# Altium schematic sheet PowerInput.SchDoc: Power
size A3; SheetNumber: 2; SheetTotal: 10
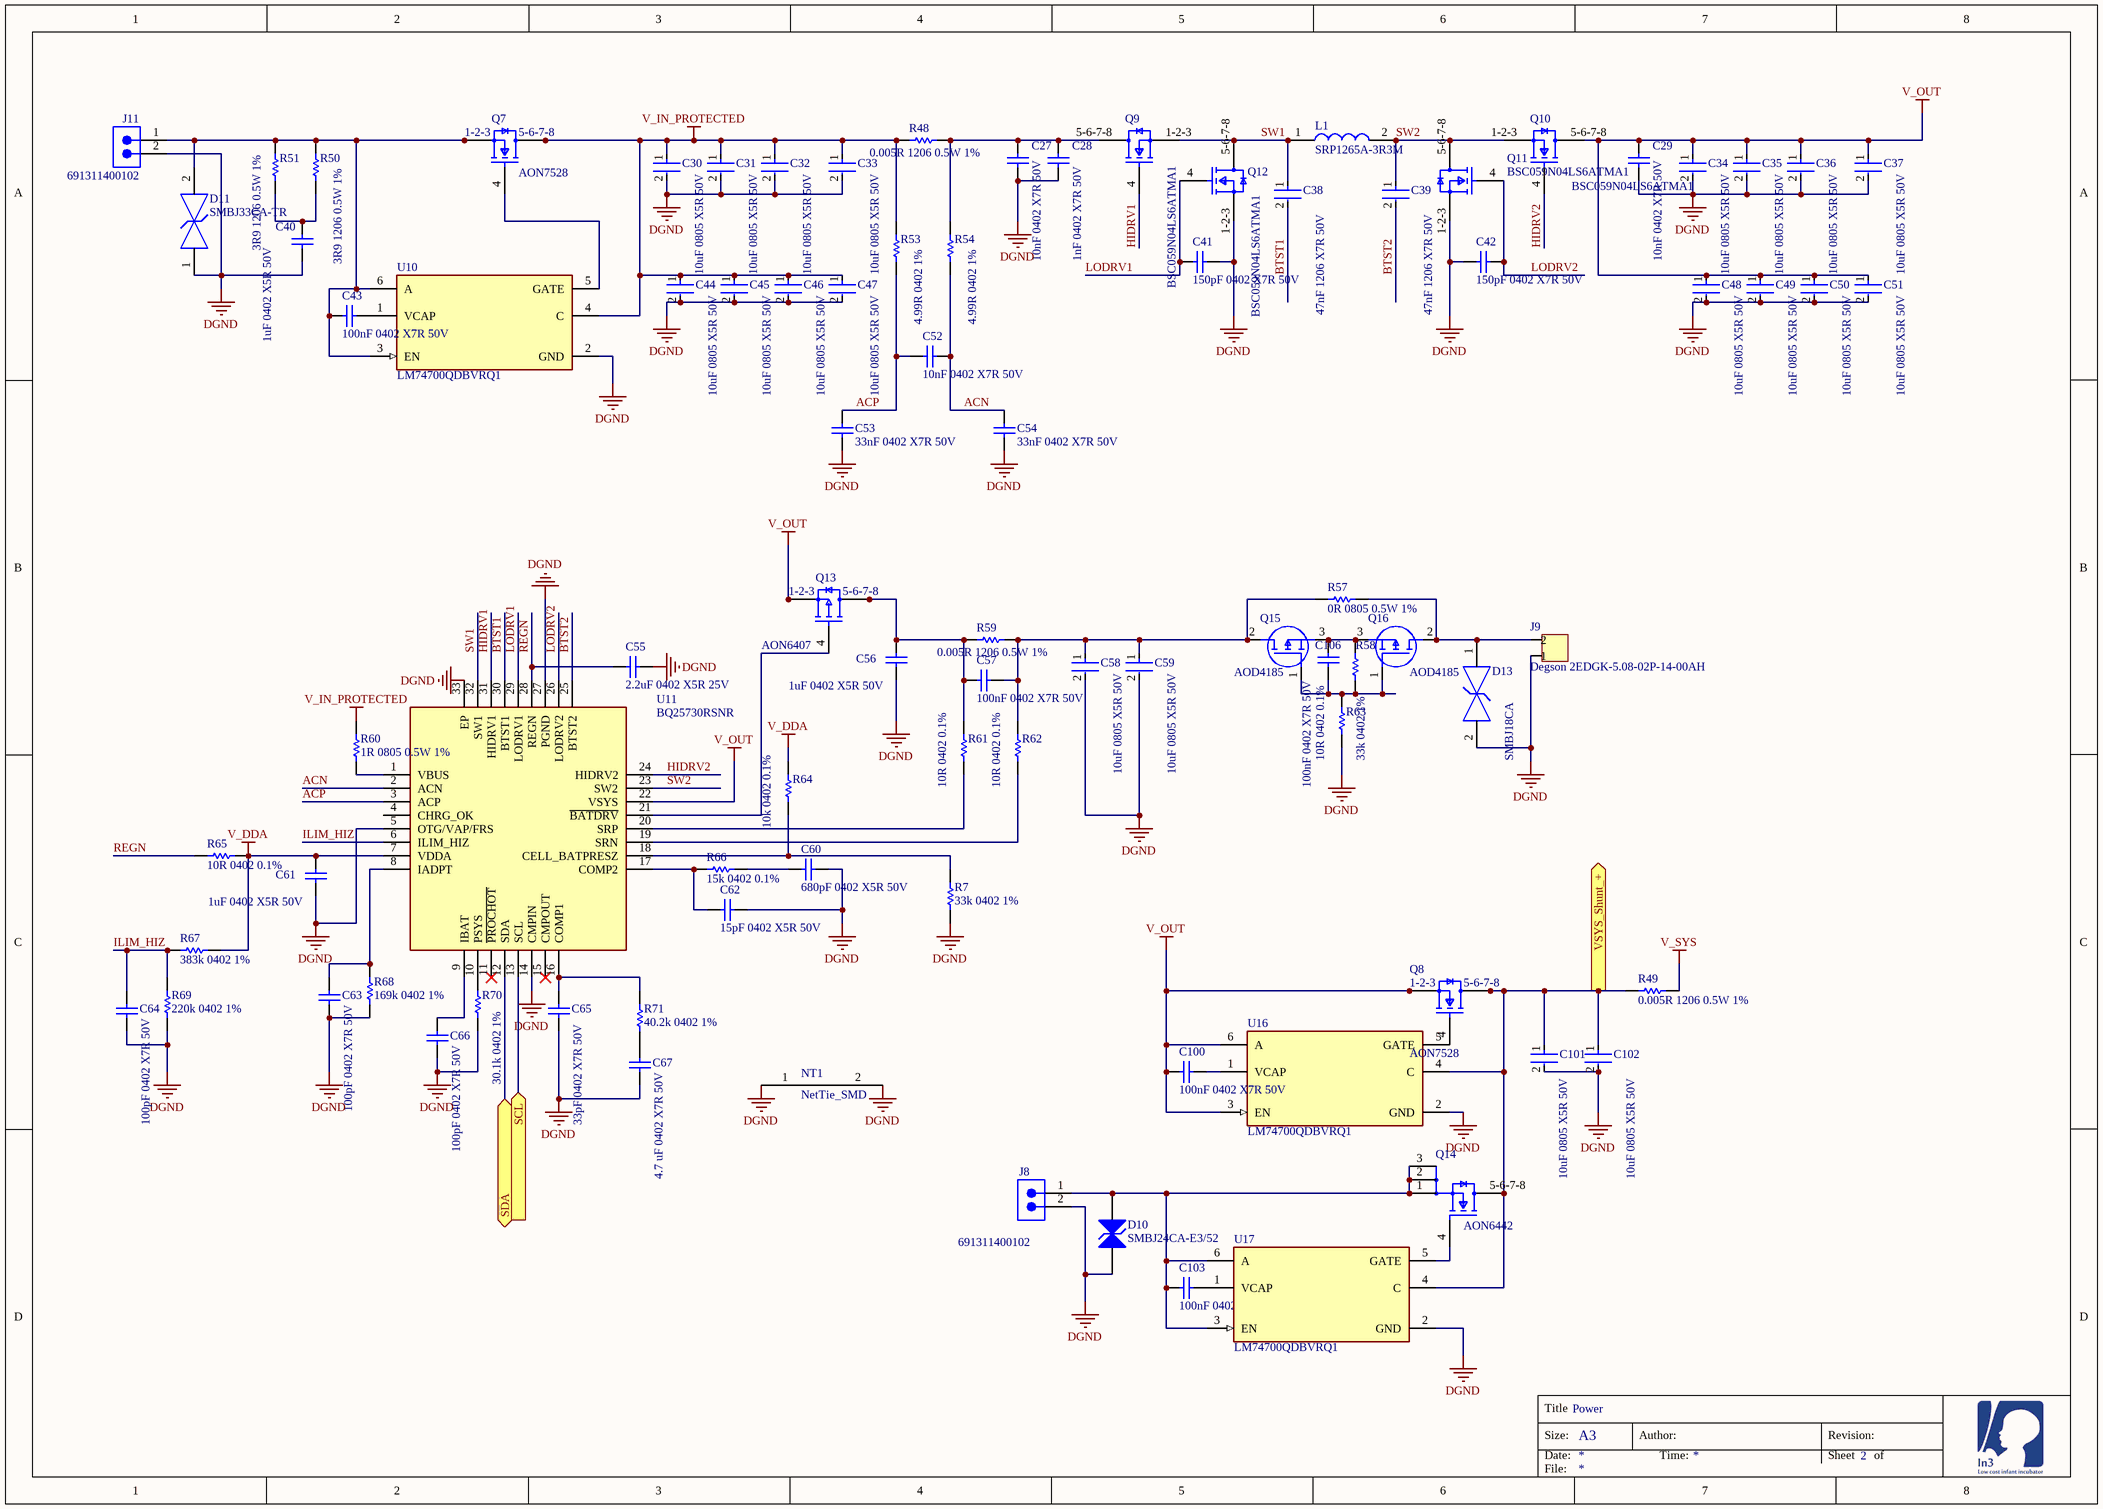
[diagram p0: PowerInput.SchDoc]

## Parts
C27  10nF 0402 X7R 50V  [CAPC1005X55X25NL5T10]
C28  1nF 0402 X7R 50V  [CAPC1005X55X25NL5T10]
C29  10nF 0402 X7R 50V  [CAPC1005X55X25NL5T10]
C30  10uF 0805 X5R 50V  [FP-GRM21B-0_2-e0_2_0_7-MFG]
C31  10uF 0805 X5R 50V  [FP-GRM21B-0_2-e0_2_0_7-MFG]
C32  10uF 0805 X5R 50V  [FP-GRM21B-0_2-e0_2_0_7-MFG]
C33  10uF 0805 X5R 50V  [FP-GRM21B-0_2-e0_2_0_7-MFG]
C34  10uF 0805 X5R 50V  [FP-GRM21B-0_2-e0_2_0_7-MFG]
C35  10uF 0805 X5R 50V  [FP-GRM21B-0_2-e0_2_0_7-MFG]
C36  10uF 0805 X5R 50V  [FP-GRM21B-0_2-e0_2_0_7-MFG]
C37  10uF 0805 X5R 50V  [FP-GRM21B-0_2-e0_2_0_7-MFG]
C38  47nF 1206 X7R 50V  [FP-CC1206-FD-MFG]
C39  47nF 1206 X7R 50V  [FP-CC1206-FD-MFG]
C40  1uF 0402 X5R 50V  [CAPC1005X55X25NL5T10]
C41  150pF 0402 X7R 50V  [CAPC1005X55X25NL5T10]
C42  150pF 0402 X7R 50V  [CAPC1005X55X25NL5T10]
C43  100nF 0402 X7R 50V  [CAPC1005X55X25NL5T10]
C44  10uF 0805 X5R 50V  [FP-GRM21B-0_2-e0_2_0_7-MFG]
C45  10uF 0805 X5R 50V  [FP-GRM21B-0_2-e0_2_0_7-MFG]
C46  10uF 0805 X5R 50V  [FP-GRM21B-0_2-e0_2_0_7-MFG]
C47  10uF 0805 X5R 50V  [FP-GRM21B-0_2-e0_2_0_7-MFG]
C48  10uF 0805 X5R 50V  [FP-GRM21B-0_2-e0_2_0_7-MFG]
C49  10uF 0805 X5R 50V  [FP-GRM21B-0_2-e0_2_0_7-MFG]
C50  10uF 0805 X5R 50V  [FP-GRM21B-0_2-e0_2_0_7-MFG]
C51  10uF 0805 X5R 50V  [FP-GRM21B-0_2-e0_2_0_7-MFG]
C52  10nF 0402 X7R 50V  [CAPC1005X55X25NL5T10]
C53  33nF 0402 X7R 50V  [CAPC1005X55X25NL5T10]
C54  33nF 0402 X7R 50V  [CAPC1005X55X25NL5T10]
C55  2.2uF 0402 X5R 25V  [CAPC1005X55X25NL5T10]
C56  1uF 0402 X5R 50V  [CAPC1005X55X25NL5T10]
C57  100nF 0402 X7R 50V  [CAPC1005X55X25NL5T10]
C58  10uF 0805 X5R 50V  [FP-GRM21B-0_2-e0_2_0_7-MFG]
C59  10uF 0805 X5R 50V  [FP-GRM21B-0_2-e0_2_0_7-MFG]
C60  680pF 0402 X5R 50V  [CAPC1005X55X25NL5T10]
C61  1uF 0402 X5R 50V  [CAPC1005X55X25NL5T10]
C62  15pF 0402 X5R 50V  [CAPC1005X55X25NL5T10]
C63  100pF 0402 X7R 50V  [CAPC1005X55X25NL5T10]
C64  100pF 0402 X7R 50V  [CAPC1005X55X25NL5T10]
C65  33pF 0402 X7R 50V  [CAPC1005X55X25NL5T10]
C66  100pF 0402 X7R 50V  [CAPC1005X55X25NL5T10]
C67  4.7 uF 0402 X7R 50V  [CAPC1005X55X25NL5T10]
C100  100nF 0402 X7R 50V  [CAPC1005X55X25NL5T10]
C101  10uF 0805 X5R 50V  [FP-GRM21B-0_2-e0_2_0_7-MFG]
C102  10uF 0805 X5R 50V  [FP-GRM21B-0_2-e0_2_0_7-MFG]
C103  100nF 0402 X7R 50V  [CAPC1005X55X25NL5T10]
C106  100nF 0402 X7R 50V  [CAPC1005X55X25NL5T10]
D10  SMBJ24CA-E3/52  [VISH-DO-214AA-A-2_V]
D11  SMBJ33CA-TR  [FP-SMB-CA-MFG]
D13  SMBJ18CA  [FP-SMBJ-MFG]
J8  691311400102  [691311400102]
J9  Degson 2EDGK-5.08-02P-14-00AH  [PCB-h4cyb3wxd4gf7j132tzl-1]
J11  691311400102  [691311400102]
L1  SRP1265A-3R3M  [INDPM135125X650N]
NT1  NetTie_SMD  [NETTIE_SMD]  (net tie, no BOM)
Q7  AON7528  [AON7520]
Q8  AON7528  [AON7520]
Q9  BSC059N04LS6ATMA1  [FP-PG-TDSON-8-MFG]
Q10  BSC059N04LS6ATMA1  [FP-PG-TDSON-8-MFG]
Q11  BSC059N04LS6ATMA1  [FP-PG-TDSON-8-MFG]
Q12  BSC059N04LS6ATMA1  [FP-PG-TDSON-8-MFG]
Q13  AON6407  [AON6414A]
Q14  AON6442  [FP-DFN5x6_8L_EP1_P-MFG]
Q15  AOD4185  [AOD4185]
Q16  AOD4185  [AOD4185]
R7  33k 0402 1%  [RESC1005X40X25ML05T10]
R48  0.005R 1206 0.5W 1%  [CAPC3216X180X55ML20T25]
R49  0.005R 1206 0.5W 1%  [CAPC3216X180X55ML20T25]
R50  3R9 1206 0.5W 1%  [CAPC3216X180X55ML20T25]
R51  3R9 1206 0.5W 1%  [CAPC3216X180X55ML20T25]
R53  4.99R 0402 1%  [RESC1005X40X25ML05T10]
R54  4.99R 0402 1%  [RESC1005X40X25ML05T10]
R57  0R 0805 0.5W 1%  [RESC2013X65X40LL15T20]
R58  33k 0402 1%  [RESC1005X40X25ML05T10]
R59  0.005R 1206 0.5W 1%  [CAPC3216X180X55ML20T25]
R60  1R 0805 0.5W 1%  [RESC2013X65X40LL15T20]
R61  10R 0402 0.1%  [RESC1005X40X25ML05T10]
R62  10R 0402 0.1%  [RESC1005X40X25ML05T10]
R63  10R 0402 0.1%  [RESC1005X40X25ML05T10]
R64  10k 0402 0.1%  [RESC1005X40X25ML05T10]
R65  10R 0402 0.1%  [RESC1005X40X25ML05T10]
R66  15k 0402 0.1%  [RESC1005X40X25ML05T10]
R67  383k 0402 1%  [RESC1005X40X25ML05T10]
R68  169k 0402 1%  [RESC1005X40X25ML05T10]
R69  220k 0402 1%  [RESC1005X40X25ML05T10]
R70  30.1k 0402 1%  [RESC1005X40X25ML05T10]
R71  40.2k 0402 1%  [RESC1005X40X25ML05T10]
U10  LM74700QDBVRQ1  [FP-DBV0006A-MFG]
U11  BQ25730RSNR  [QFN40P400X400X80-33N-D]
U16  LM74700QDBVRQ1  [FP-DBV0006A-MFG]
U17  LM74700QDBVRQ1  [FP-DBV0006A-MFG]

## Ports
SCL (in), SDA (bidir), VSYS_Shunt_+ (out)

## Nets
DGND: C27.1 C28.1 C29.1 C30.2 C31.2 C32.2 C33.2 C34.2 C35.2 C36.2 C37.2 C40.1 C41.1 C42.1 C44.2 C45.2 C46.2 C47.2 C48.2 C49.2 C50.2 C51.2 C53.2 C54.2 C55.1 C56.1 C58.2 C59.2 C60.1 C61.1 C62.1 C63.2 C64.2 C65.2 C66.2 C67.2 C101.2 C102.2 D10.1(A) D11.1 D13.2 J8.2 J9.1 J11.2 NT1.1 NT1.2 Q11.1-2-3(S) Q12.1-2-3(S) R7.2 R63.1 R68.2 R69.2 R70.2 U10.2(GND) U11.5(OTG/VAP/FRS) U11.14(CMPIN) U11.27(PGND) U11.33(EP) U16.2(GND) U17.2(GND)
V_DDA: C61.2 R64.2 R65.1 R67.1 U11.7(VDDA)
V_IN_PROTECTED: C30.1 C31.1 C32.1 C33.1 C44.1 C45.1 C46.1 C47.1 Q7.5(D) Q7.6(D) Q7.7(D) Q7.8(D) Q7.9(D) R48.2 R53.2 R60.2 U10.4(C)
V_OUT: C29.2 C34.1 C35.1 C36.1 C37.1 C48.1 C49.1 C50.1 C51.1 C100.2 Q8.1(1-2-3) Q8.2(S) Q8.3(S) Q10.5-6-7-8(D) Q13.1(1-2-3) Q13.2(S) Q13.3(S) U11.22(VSYS) U16.3(EN) U16.6(A)
V_SYS: R49.1
ACN: C52.1 C54.1 R54.1 U11.2(ACN)
ACP: C52.2 C53.1 R53.1 U11.3(ACP)
BTST1: C38.2 U11.30(BTST1)
BTST2: C39.2 U11.25(BTST2)
HIDRV1: Q9.4(G) U11.31(HIDRV1)
HIDRV2: Q10.4(G) U11.24(HIDRV2)
ILIM_HIZ: C64.1 R67.2 R69.1 U11.6(ILIM_HIZ)
LODRV1: C41.2 Q12.4(G) U11.29(LODRV1)
LODRV2: C42.2 Q11.4(G) U11.26(LODRV2)
REGN: C55.2 R65.2 U11.28(REGN)
SCL: U11.13(SCL) ; port SCL
SDA: U11.12(SDA) ; port SDA
SW1: C38.1 L1.1 Q9.1-2-3(S) Q12.5-6-7-8(D) U11.32(SW1)
SW2: C39.1 L1.2 Q10.1-2-3(S) Q11.5-6-7-8(D) U11.23(SW2)
VSYS_Shunt_+: C101.1 C102.1 Q8.5(D) Q8.6(D) Q8.7(D) Q8.8(D) Q8.9(D) Q14.5-6-7-8(D) R49.2 U16.4(C) U17.4(C) ; port VSYS_Shunt_+
NetC27_2: C27.2 C28.2 Q9.5-6-7-8(D) R48.1 R54.2
NetC40_2: C40.2 R50.2 R51.2
NetC43_1: C43.1 U10.1(VCAP)
NetC43_2: C43.2 D11.2 J11.1 Q7.1(1-2-3) Q7.2(S) Q7.3(S) R50.1 R51.1 U10.3(EN) U10.6(A)
NetC56_2: C56.2 C57.2 Q13.5(D) Q13.6(D) Q13.7(D) Q13.8(D) Q13.9(D) R59.2 R61.2
NetC57_1: C57.1 C58.1 C59.1 Q15.2(D) R57.1 R59.1 R62.2
NetC60_2: C60.2 R66.1
NetC62_2: C62.2 R66.2 U11.17(COMP2)
NetC63_1: C63.1 R68.1 U11.8(IADPT)
NetC65_1: C65.1 R71.1 U11.16(COMP1)
NetC66_1: C66.1 U11.9(IBAT)
NetC67_1: C67.1 R71.2
NetC100_1: C100.1 U16.1(VCAP)
NetC103_1: C103.1 U17.1(VCAP)
NetC103_2: C103.2 D10.2(A) J8.1 Q14.1(S) Q14.2(S) Q14.3(S) U17.3(EN) U17.6(A)
NetC106_1: C106.1 Q15.3(S) Q16.3(S) R58.1
NetC106_2: C106.2 Q15.1(G) Q16.1(G) R58.2 R63.2
NetD13_1: D13.1 J9.2 Q16.2(D) R57.2
NetQ7_4: Q7.4(G) U10.5(GATE)
NetQ8_4: Q8.4(G) U16.5(GATE)
NetQ13_4: Q13.4(G) U11.21(~{BATDRV})
NetQ14_4: Q14.4(G) U17.5(GATE)
NetR7_1: R7.1 R64.1 U11.18(CELL_BATPRESZ)
NetR60_1: R60.1 U11.1(VBUS)
NetR61_1: R61.1 U11.20(SRP)
NetR62_1: R62.1 U11.19(SRN)
NetR70_1: R70.1 U11.10(PSYS)

Not connected (* = marked no-connect by the designer): U11 4(CHRG_OK) 11(~{PROCHOT})* 15(CMPOUT)*

## Notes on the sheet
- Title
- Size:
- Date:
- A3
- Author:
- Time:
- Revision:
- Sheet
- of
- File:
- (in symbol AON6407) 5-6-7-8
- (in symbol AON7528) 5-6-7-8

## Library data of the parts
C27-C29 C40-C43 C52-C57 C60-C67 C100 C103 C106 = CMP-1662-00020-1: ComponentLink2Description: Datasheet; ComponentLink2URL: http://psearch.en.murata.com/capacitor/product/GRM155R60J105KE19%23.pdf; ComponentLink1Description: Manufacturer URL; ComponentLink1URL: http://www.murata.com/
  C27 C29 C52: LCSC_PN: C60133
  C28: LCSC_PN: C93920
  C40 C56 C61: LCSC_PN: C1518208
  C41 C42: LCSC_PN: C113789
  C43 C57 C100 C103 C106: LCSC_PN: C77020
  C53 C54: LCSC_PN: C106862
  C55: LCSC_PN: C77002
  C60: LCSC_PN: C307451
  C62: LCSC_PN: C86285
  C63 C64 C66: LCSC_PN: C281751
  C65: LCSC_PN: C107005
  C67: LCSC_PN: C23733
C30-C37 C44-C51 C58 C59 C101 C102 = CMP-06035-048920-1: Chip Multilayer Ceramic Capacitors for General Purpose, 0805, 10uF, X5R, 15%, 10%, 35V; Max Operating Temperature: 85°C; REACH SVHC: No SVHC; Packaging: Tape and Reel; Thickness: 0.057inch; Tolerance: 10%; Capacitance: 10uF; Case Code (Imperial): 0805; Height: 1.25mm; Width: 0.049inch; Length: 0.079inch; Lead Free: Lead Free; Voltage Rating: 35V; Case/Package: 0805; Dielectric: X5R; Min Operating Temperature: -55°C; Package Quantity: 3000; Termination: SMD/SMT; Case Code (Metric): 2012; Weight: 0.000335oz; Mount: Surface Mount; Voltage Rating (DC): 35V; LCSC_PN: C2932476
C38 C39 = CMP-03422-001420-1: CAP CER 10UF 50V X5R 1206; Tolerance: 10%; Voltage Rating (DC): 50V; Width: 0.063inch; Halogen Free: Halogen Free; Mount: Surface Mount; Dielectric: X5R; Max Operating Temperature: 85°C; Capacitance: 47nF; Case/Package: 1206; Voltage Rating: 50V; Lead Free: Lead Free; Thickness: 0.075inch; Min Operating Temperature: -55°C; Length: 0.126inch; Packaging: Tape and Reel; RoHS Compliant: Yes; LCSC_PN: C107209
D10 = CMP-2000-07094-1: TRANSZORB(R) Transient Voltage Suppressor, 24 V, -55 to 150 degC, 2-Pin DO-214AA (SMBJ), RoHS, Tape and Reel; Manufacturer: Vishay; Clamping Voltage Vc Max: 38.9V; Peak Pulse Current Ippm: 14A; Product Range: TRANSZORBSMBJSeries; Power Dissipation Pd: 600W; Breakdown Voltage Min: 26.7V; No. of Pins: 2Pins; SVHC: ToBeAdvised; Breakdown Voltage Max: 29.5V; TVS Polarity: Bidirectional; Reverse Stand-Off Voltage Vrwm: 24V; Mounting Technology: SurfaceMount; Package Reference: DO-214AA; Package Description: 2-Pin Surface Mount Device, Body 4.315 x 3.62 mm; Diode Case Style: DO-214AA; Packaging: CutTape; Datasheet URL: http://www.vishay.com/docs/88392/smbj50a.pdf; Peak Pulse Power Dissipation: 600W; Manufacturer URL: http://www.vishay.com/; Datasheet Version: 02/2014; LCSC_PN: C83268
D11 = CMP-12225-000040-1: TVS DIODE 33V 69.7V SMB; Manufacturer: STMicroelectronics; Direction: Bidirectional; Peak Pulse Current: 11.8A; Peak Pulse Power: 600W; Clamping Voltage: 53.3V; Breakdown Voltage: 36.7V; Number Of Channels: 1; Standoff Height: 0.05mm; Max Junction Temp: +150°C; Lead Free: Yes; Device Class L1: Circuit Protection; Device Class L3: unset; Mouser Description: TVS Diodes - Transient Voltage Suppressors 600W 33V Bidirect; Device Class L2: TVS Diodes; Temperature Range High: +150°C; Temperature: -55°C to +150°C; Temperature Range Low: -55°C; Octopart: https://octopart.com/smbj33ca-tr-stmicroelectronics-347069; Manufacturer Part Number: SMBJ33CA-TR; Automotive: No; ComponentLink2URL: https://www.st.com/resource/en/datasheet/smbj.pdf; RoHS: TRUE; Package: SMB-CA; Category: Diode; ComponentLink2Description: Datasheet; Height: 2.65mm; Reverse Standoff Voltage: 33V; Digikey Description: TVS DIODE 33V 69.7V SMB; LCSC_PN: C83325
D13 = CMP-08607-000021-1: TVS DIODE 18V 29.2V DO214AA; Manufacturer: Littelfuse Inc; Number Of Channels: 1; Peak Pulse Power: 600W; Max Junction Temp: +150°C; Peak Pulse Current: 20.6A; Direction: Bidirectional; Breakdown Voltage: 20V; RoHS: TRUE; Lead Free: Yes; Category: Diode; Clamping Voltage: 29.2V; Height: 2.61mm; Manufacturer Part Number: SMBJ18CA; Reverse Standoff Voltage: 18V; Device Class L3: unset; Device Class L2: TVS Diodes; Package: SMBJ; Digikey Description: TVS DIODE 18V 29.2V DO214AA; Device Class L1: Circuit Protection; ComponentLink2Description: Datasheet; ComponentLink2URL: https://www.littelfuse.com/~/media/electronics/datasheets/tvs_diodes/littelfuse_tvs_diode_smbj_datasheet.pdf.pdf; Temperature: -65°C to +150°C; Temperature Range High: +150°C; Mouser Description: SMBJ Series 29.2 V 0.6 kW Surface Mount Bi-Directional TVS Diode - DO-214AA; Automotive: No; Octopart: https://octopart.com/smbj18ca-littelfuse-350695; Temperature Range Low: -65°C; LCSC_PN: C83327
J8 J11 = CMP-1502-02408-3: 7.62MM Pitch Straight Pluggable Term Block, Pcb Header, Through Hole, 2 Way; Number of Positions Per Level: 2; Gender: Male; Number of Levels: 1; Voltage: 300V; Current: 20A; Contact Gender: Male; Termination: Solder; Mount: Through Hole; Height: 16mm; Pitch: 7.62mm; Orientation: Vertical; Number of Rows: 1; Packaging: Box; Lead Pitch: 7.62mm; Contact Material: Brass; Width: 15.24mm; Number of Contacts: 2; RoHS: Compliant; Color: Green; Length: 8.5mm; Number of Pins: 2; Current Rating: 20A; LCSC_PN: C19724644
J9 = CMP-7a42b7ee166ba585-1: Terminal block, 5mm 2 Pos, through hole male.; Manufacturer Part Number: 2EDGK-5.08-02P-14-00AH + 2EDGVC-5.08-02P; Octopart URL: https://octopart.com/2edgk-5.08-02p-14-00ah-degson-78006607; OctopartID: 7a42b7ee166ba585; Manufacturer Part Number 2: WJ2EDGVC-5.08-2P + WJ2EDGK-5.08-2P; LCSC_PN: C8445
L1 = SRP1265A-3R3M: Inductor; Manufacturer_Name: Bourns; Datasheet Link: https://www.bourns.com/data/global/pdfs/SRP1265A.pdf; Height: 6.5mm; Manufacturer_Part_Number: SRP1265A-3R3M; Mouser Part Number: 652-SRP1265A-3R3M; Mouser Price/Stock: https://www.mouser.co.uk/ProductDetail/Bourns/SRP1265A-3R3M?qs=7z%252BmIopC6%2FKn2Zz%252BiwrXSg%3D%3D; Arrow Part Number: SRP1265A-3R3M; Arrow Price/Stock: https://www.arrow.com/en/products/srp1265a-3r3m/bourns?utm_currency=USD&region=nac; LCSC_PN: C19268665
NT1 = NetTie_SMD: Net Tie SMD
Q7 Q8 = AON7528: MOSFET (N-Channel); Manufacturer_Name: Alpha & Omega Semiconductors; Datasheet Link: http://aosmd.com/res/data_sheets/AON7528.pdf; Manufacturer_Part_Number: AON7528; Arrow Part Number: AON7528; Arrow Price/Stock: https://www.arrow.com/en/products/aon7528/alpha-and-omega-semiconductor?utm_currency=USD&region=nac; LCSC_PN: C5297617
Q9-Q12 = CMP-32901-000139-1: TRENCH <= 40V; Manufacturer: Infineon; Transconductance: 100S; Turn On Delay Time: 3ns; Number Of Channels: 1; Gate Charge At Vgs: 9.4nC @ 10V; Continuous Drain Current: 17A; Max Junction Temp: +175°C; Reverse Recovery Charge: 22nC; Turn Off Delay Time: 8ns; Input Capacitace At Vds: 640pF @ 20V; Typ Forward Diode Voltage: 0.92V; Threshold Vgs Max: 2.3V; Max Forward Diode Voltage: 1V; Power Dissipation: 3W; Depletion Mode: False; Threshold Vgs Min: 1.3V; Gate To Source Voltage: 20V; Pulse Drain Current: 236A; Reverse Recovery Time: 13ns; Rthja Max: 50°C/W; Drain To Source Resistance: 4.7mΩ; Temperature Range High: +175°C; Package: PG-TDSON-8; Digikey Description: TRENCH <= 40V; Temperature Range Low: -55°C; Footprint Url: https://www.infineon.com/cms/en/product/packages/PG-TDSON/PG-TDSON-8-17/; Number Of N Channels: 1; Drain To Source Voltage: 40V; RoHS: TRUE; Temperature: -55°C to +175°C; Category: Trans; ComponentLink2URL: https://www.infineon.com/dgdl/Infineon-BSC059N04LS6-DS-v02_00-EN.pdf?fileId=5546d462689a790c0168bd22cfc6481f; Drain To Source Breakdown Voltage: 40V; Device Class L2: Transistors; Manufacturer Part Number: BSC059N04LS6ATMA1; ComponentLink2Description: Datasheet; Device Class L3: MOSFETs; Height: 1.1mm; Automotive: No; Octopart: https://octopart.com/bsc059n04ls6atma1-infineon-98039929; Lead Free: Yes; Device Class L1: Discrete Semiconductors; LCSC_PN: C534356
Q13 = AON6407: MOSFET (P-Channel); Manufacturer_Name: Alpha & Omega Semiconductors; Datasheet Link: http://www.aosmd.com/res/data_sheets/AON6407.pdf; Manufacturer_Part_Number: AON6407; Arrow Part Number: AON6407; Arrow Price/Stock: https://www.arrow.com/en/products/aon6407/alpha-and-omega-semiconductor?utm_currency=USD&region=nac; LCSC_PN: C13899
Q14 = CMP-83955-000025-1: MOSFET N-CH 40V 22A/32A 8DFN; Max Power Dissipation: 35.7W; Rds On Max: 4.8mR; Input Capacitance: 2.2nF; Continuous Drain Current (ID): 32A; Max Operating Temperature: 150°C; Mount: Surface Mount; Min Operating Temperature: -55°C; Series: -; Package Quantity: 3000; Packaging: Cut Tape; RoHS Compliant: Yes; Case/Package: DFN; Drain to Source Voltage (Vdss): 40V; LCSC_PN: C182465
Q15 Q16 = AOD4185: MOSFET (P-Channel); Manufacturer_Name: Alpha & Omega Semiconductors; Datasheet Link: http://aosmd.com/res/data_sheets/AOD4185.pdf; Height: 2.4mm; Manufacturer_Part_Number: AOD4185; Arrow Part Number: AOD4185; Arrow Price/Stock: https://www.arrow.com/en/products/aod4185/alpha-and-omega-semiconductor?utm_currency=USD&region=europe; LCSC_PN: C400894
R7 R53 R54 R58 R61-R71 = CMP-2002-07472-1
  R7 R58: LCSC_PN: C138003
  R53 R54: LCSC_PN: C844114
  R61-R63 R65: LCSC_PN: C138066
  R64: LCSC_PN: C190095
  R66: LCSC_PN: C852545
  R67: LCSC_PN: C2076791
  R68: LCSC_PN: C327367
  R69: LCSC_PN: C138030
  R70: LCSC_PN: C138009
  R71: LCSC_PN: C137983
R48-R51 R59 = CMP-0abdc173b10ad57a-1: Manufacturer Part Number: WSLP12065L000FEA; Resistance: 0,024; Power: 1W; Octopart URL: https://octopart.com/1-2176055-0-te+connectivity-46440145; Case/Package: 1206; Lifecycle Status: Not Listed by Manufacturer; Packaging: Tape & Reel (TR); OctopartID: 0abdc173b10ad57a; OrderingCode: WSLP12065L000FEA; Manufacturer Part Number 2: FMF06FTHR005-LHL
  R48 R49 R59: LCSC_PN: C728276
  R50 R51: LCSC_PN: C17885
R57 R60 = CMP-2000-07514-1: Chip Resistor, 0 Ohm, 0.125 W, -55 to 125 degC, 0805 (2012 Metric), RoHS, Tape and Reel; Manufacturer: TE Connectivity; Power Rating: 125mW; Voltage Rating: 150V; Tolerance: 0%; Case\/Package: 0805; Number of Resistors: 1; Resistance: 0mOhm; Datasheet URL: www.te.com/commerce/DocumentDelivery/DDEController?Action=showdoc&DocId=Customer+Drawing%7F1623401%7FBA%7Fpdf%7FEnglish%7FENG_CD_1623401_BA.pdf%7F1623401-1; Composition: ThickFilm; Max Operating Temperature: 125degC; Min Operating Temperature: -55degC; ELV: Compliant; Case Code (Metric): 2012; Number of Terminations: 2; Weight: 0.000194oz; Length: 2mm; Mount: SurfaceMount; Packaging: TapeandReel; Case Code (Imperial): 0805; RoHSCompliant: true; Width: 1.25mm; Radiation Hardening: No; Termination: Solder; Manufacturer URL: http://www.te.com/; Package Description: 2-Pin Surface Mount Device, Body 2 x 1.25 mm; Mounting Technology: SurfaceMount; Height: 0.55mm; Package Quantity: 5000; Package Reference: RESC2013X65X40L15T20; Datasheet Version: Rev. BA, 12/2009; Depth: 1.25mm
  R57: LCSC_PN: C100045
  R60: LCSC_PN: C144579
U10 U16 U17 = CMP-04910-000003-1: POWER MANAGEMENT; Manufacturer: Texas Instruments; Number Of Outputs: 1; Standoff Height: 0mm; Automotive Grade: Grade 1; Nominal Supply Current: 80uA; Max Junction Temp: +150°C; Max Supply Voltage: 65V; Min Supply Voltage: 3.2V; Octopart: https://octopart.com/lm74700qdbvrq1-texas+instruments-87700446; Height: 1.45mm; Manufacturer Part Number: LM74700QDBVRQ1; Mouser Description: Low Iq, ideal diode controller 6-SOT-23 -40 to 125; Lead Free: Yes; Package: DBV0006A; Device Class L1: Integrated Circuits (ICs); Ambient Temperature Range Low: -40°C; Device Class L2: Power Management ICs; Category: IC; Ambient Temperature Range High: +125°C; RoHS: TRUE; Temperature Range Low: -40°C; Automotive: Yes; Temperature: -40°C to +125°C; Temperature Range High: +125°C; Device Class L3: unset; ComponentLink2URL: http://www.ti.com/lit/ds/symlink/lm74700-q1.pdf; ComponentLink2Description: Datasheet; Digikey Description: POWER MANAGEMENT; LCSC_PN: C2941042
U11 = BQ25730RSNR: Integrated Circuit; Manufacturer_Name: Texas Instruments; Datasheet Link: https://www.ti.com/lit/ds/symlink/bq25730.pdf?ts=1623420063043&ref_url=https%253A%252F%252Fwww.ti.com%252Fstore%252Fti%252Fen%252Fp%252Fproduct%252F%253Fp%253DBQ25730RSNR; Height: 0.8mm; Manufacturer_Part_Number: BQ25730RSNR; Mouser Part Number: 595-BQ25730RSNR; Mouser Price/Stock: https://www.mouser.co.uk/ProductDetail/Texas-Instruments/BQ25730RSNR?qs=stqOd1AaK78USmb51n%2Fwlg%3D%3D; Arrow Part Number: BQ25730RSNR; Arrow Price/Stock: https://www.arrow.com/en/products/bq25730rsnr/texas-instruments?region=nac; LCSC_PN: C5219071